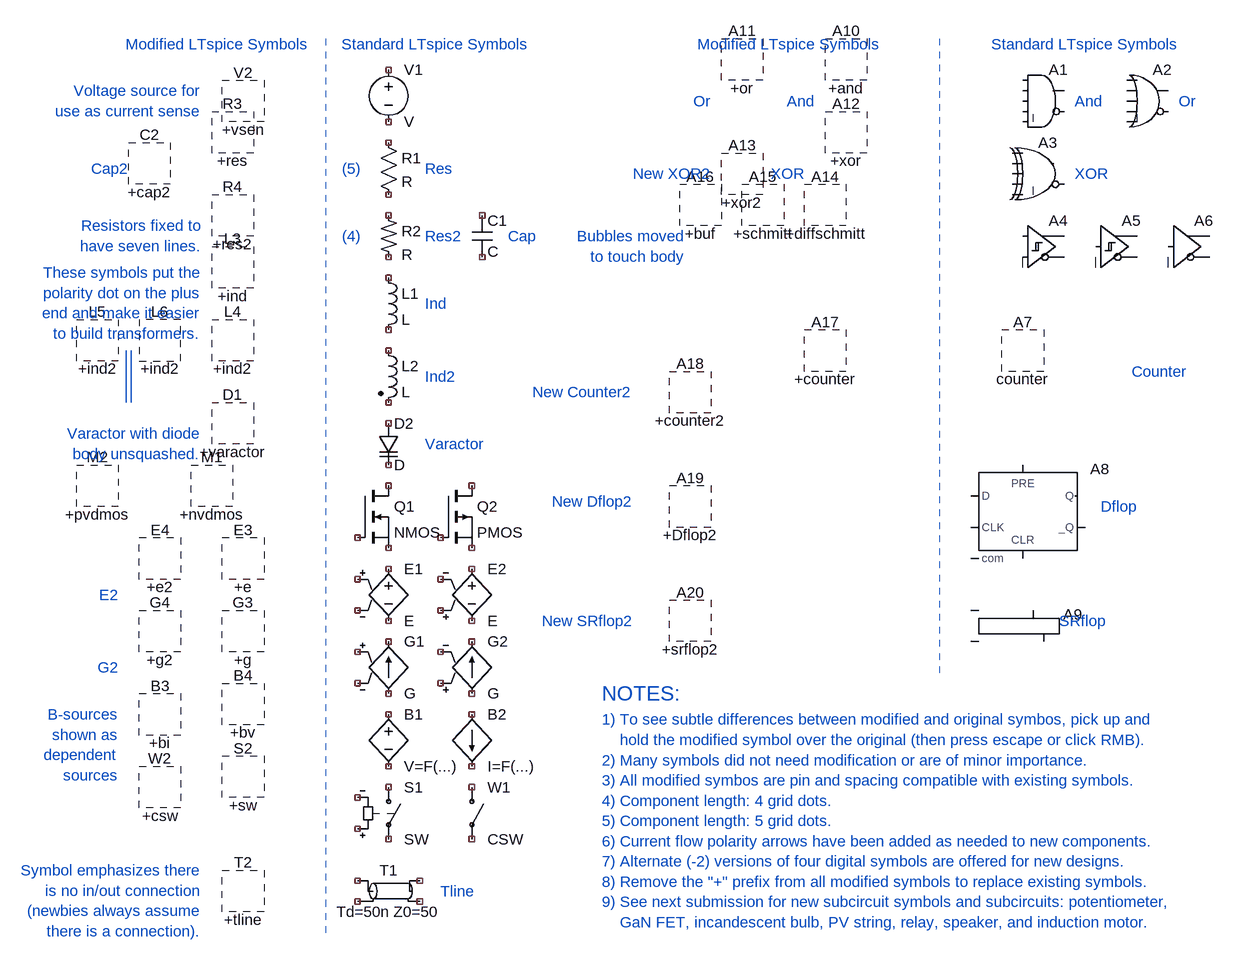
[diagram p0: schematic symbols.asc]
symbols.asc, the LTspice schematic file:
Version 4
SHEET 1 2616 1896
SYMBOL +varactor -160 224 R0
SYMATTR InstName D1
SYMATTR Description Diode
SYMBOL res 64 -224 R0
SYMATTR InstName R1
SYMBOL res2 64 -96 R0
SYMATTR InstName R2
SYMBOL ind 64 -16 R0
SYMATTR InstName L1
SYMBOL ind2 64 96 R0
SYMATTR InstName L2
SYMBOL varactor 64 224 R0
SYMATTR InstName D2
SYMBOL e 80 432 R0
SYMATTR InstName E1
SYMBOL e2 208 432 R0
SYMATTR InstName E2
SYMBOL g 80 544 R0
SYMATTR InstName G1
SYMBOL g2 208 544 R0
SYMATTR InstName G2
SYMBOL sw 80 768 R0
SYMATTR InstName S1
SYMBOL csw 208 784 R0
SYMATTR InstName W1
SYMBOL tline 80 944 R0
SYMATTR InstName T1
SYMBOL Digital\\and 1088 -336 R0
SYMATTR InstName A1
SYMBOL Digital\\or 1248 -336 R0
SYMATTR InstName A2
SYMBOL Digital\\xor 1088 -224 R0
SYMATTR InstName A3
SYMBOL Digital\\diffschmitt 1056 -112 R0
SYMATTR InstName A4
SYMBOL Digital\\schmitt 1168 -112 R0
SYMATTR InstName A5
SYMBOL Digital\\buf 1280 -112 R0
SYMATTR InstName A6
SYMBOL Digital\\counter 1056 112 R0
SYMATTR InstName A7
SYMBOL Digital\\dflop 1056 288 R0
SYMATTR InstName A8
SYMBOL Digital\\srflop 1024 464 R0
SYMATTR InstName A9
SYMBOL +res -160 -224 R0
SYMATTR InstName R3
SYMATTR Description A resistor
SYMBOL +res2 -160 -96 R0
SYMATTR InstName R4
SYMATTR Description A resistor
SYMBOL +ind -160 -16 R0
SYMATTR InstName L3
SYMBOL +ind2 -160 96 R0
SYMATTR InstName L4
SYMBOL +ind2 -368 96 R0
SYMATTR InstName L5
SYMBOL +ind2 -272 96 M0
SYMATTR InstName L6
SYMBOL +e -144 432 R0
SYMATTR InstName E3
SYMBOL +e2 -272 432 R0
SYMATTR InstName E4
SYMBOL +g -144 544 R0
SYMATTR InstName G3
SYMBOL +g2 -272 544 R0
SYMATTR InstName G4
SYMBOL +sw -144 768 R0
SYMATTR InstName S2
SYMBOL +csw -272 784 R0
SYMATTR InstName W2
SYMBOL +tline -144 944 R0
SYMATTR InstName T2
SYMBOL +and 784 -336 R0
SYMATTR InstName A10
SYMBOL +or 624 -336 R0
SYMATTR InstName A11
SYMBOL +xor 784 -224 R0
SYMATTR InstName A12
SYMATTR Description Behavioral OR gate with complementary outputs
SYMBOL +xor2 624 -160 R0
SYMATTR InstName A13
SYMATTR Description Behavioral OR gate with complementary outputs
SYMBOL +diffschmitt 752 -112 R0
SYMATTR InstName A14
SYMBOL +schmitt 656 -112 R0
SYMATTR InstName A15
SYMBOL +buf 560 -112 R0
SYMATTR InstName A16
SYMBOL +counter 752 112 R0
SYMATTR InstName A17
SYMBOL +counter2 544 176 R0
SYMATTR InstName A18
SYMBOL +Dflop2 544 352 R0
SYMATTR InstName A19
SYMBOL +srflop2 544 528 R0
SYMATTR InstName A20
SYMBOL bv 80 656 R0
SYMATTR InstName B1
SYMBOL bi 208 672 R0
SYMATTR InstName B2
SYMBOL +bi -272 672 R0
SYMATTR InstName B3
SYMBOL +bv -144 656 R0
SYMATTR InstName B4
SYMBOL nmos 32 320 R0
SYMATTR InstName Q1
SYMBOL pmos 160 320 R0
SYMATTR InstName Q2
SYMBOL voltage 80 -336 R0
SYMATTR InstName V1
SYMBOL cap 208 -96 R0
SYMATTR InstName C1
SYMBOL +cap2 -288 -176 R0
SYMATTR InstName C2
SYMBOL +nvdmos -192 320 R0
SYMATTR InstName M1
SYMBOL +pvdmos -368 320 R0
SYMATTR InstName M2
SYMBOL +vsen -144 -272 R0
SYMATTR InstName V2
TEXT 152 -344 Bottom 2 ;Standard LTspice Symbols
TEXT -184 -344 Bottom 2 ;Modified LTspice Symbols
TEXT 136 -64 Left 2 ;Res2
TEXT 136 -168 Left 2 ;Res
TEXT 160 944 Left 2 ;Tline
TEXT -208 912 Right 2 ;Symbol emphasizes there\nis no in/out connection\n(newbies always assume\nthere is a connection).
TEXT 136 40 Left 2 ;Ind
TEXT 136 152 Left 2 ;Ind2
TEXT -208 -8 Right 2 ;These symbols put the\npolarity dot on the plus\nend and make it easier\nto build transformers.
TEXT 1224 144 Left 2 ;Counter
TEXT 1176 352 Left 2 ;Dflop
TEXT 1112 528 Left 2 ;SRflop
TEXT 456 528 Right 2 ;New SRflop2
TEXT 456 344 Right 2 ;New Dflop2
TEXT 136 256 Left 2 ;Varactor
TEXT -208 240 Right 2 ;Varactor with diode\nbody unsquashed.
TEXT -208 -80 Right 2 ;Resistors fixed to\nhave seven lines.
TEXT 456 176 Right 2 ;New Counter2
TEXT 576 -160 Right 2 ;New XOR2
TEXT 536 -64 Right 2 ;Bubbles moved\nto touch body
TEXT 1136 -272 Left 2 ;And
TEXT 1296 -272 Left 2 ;Or
TEXT 1136 -160 Left 2 ;XOR
TEXT 696 -344 Bottom 2 ;Modified LTspice Symbols
TEXT 1152 -344 Bottom 2 ;Standard LTspice Symbols
TEXT -336 488 Right 2 ;E2
TEXT -336 600 Right 2 ;G2
TEXT 408 640 Left 3 ;NOTES:
TEXT 408 680 Left 2 ;1) To see subtle differences between modified and original symbos, pick up and\n    hold the modified symbol over the original (then press escape or click RMB).\n2) Many symbols did not need modification or are of minor importance.\n3) All modified symbos are pin and spacing compatible with existing symbols.\n4) Component length: 4 grid dots.\n5) Component length: 5 grid dots.\n6) Current flow polarity arrows have been added as needed to new components.\n7) Alternate (-2) versions of four digital symbols are offered for new designs.\n8) Remove the "+" prefix from all modified symbols to replace existing symbols.\n9) See next submission for new subcircuit symbols and subcircuits: potentiometer,\n    GaN FET, incandescent bulb, PV string, relay, speaker, and induction motor.
TEXT -336 672 Right 2 ;B-sources\nshown as\ndependent\nsources
TEXT 736 -272 Right 2 ;And
TEXT 576 -272 Right 2 ;Or
TEXT 720 -160 Right 2 ;XOR
TEXT -208 -288 Right 2 ;Voltage source for\nuse as current sense
TEXT 264 -64 Left 2 ;Cap
TEXT -320 -168 Right 2 ;Cap2
TEXT 8 -168 Left 2 ;(5)
TEXT 8 -64 Left 2 ;(4)
LINE Normal 928 608 928 -368 1
LINE Normal -16 1008 -16 -368 1
LINE Normal -316 192 -316 112
LINE Normal -324 112 -324 192

The netlist it stands for:
* symbols.asc
* D1: +varactor (symbol +varactor not available, pin order unknown); nets seen at it: 
R1 NC_01 NC_02 R
R2 NC_03 NC_04 R
L1 NC_05 NC_06 L
L2 NC_07 NC_08 L
D2 NC_09 NC_10 D
E1 NC_11 NC_12 NC_13 NC_14 E
E2 NC_15 NC_16 NC_17 NC_18 E
G1 NC_19 NC_20 NC_21 NC_22 G
G2 NC_23 NC_24 NC_25 NC_26 G
S1 NC_27 NC_28 NC_29 NC_30 SW
W1 NC_31 NC_32 CSW
T1 NC_33 NC_34 NC_35 NC_36 Td=50n Z0=50
A1 0 0 0 0 0 0 0 0 AND
A2 0 0 0 0 0 0 0 0 OR
A3 0 0 0 0 0 0 0 0 XOR
A4 0 0 0 0 0 0 0 0 SCHMITT
A5 0 0 0 0 0 0 0 0 SCHMITT
A6 0 0 0 0 0 0 0 0 BUF
* A7: counter (symbol Digital\counter not available, pin order unknown); nets seen at it: 
A8 0 0 0 0 0 0 0 0 DFLOP
A9 0 0 0 0 0 0 0 0 SRFLOP
* R3: +res (symbol +res not available, pin order unknown); nets seen at it: 
* R4: +res2 (symbol +res2 not available, pin order unknown); nets seen at it: 
* L3: +ind (symbol +ind not available, pin order unknown); nets seen at it: 
* L4: +ind2 (symbol +ind2 not available, pin order unknown); nets seen at it: 
* L5: +ind2 (symbol +ind2 not available, pin order unknown); nets seen at it: 
* L6: +ind2 (symbol +ind2 not available, pin order unknown); nets seen at it: 
* E3: +e (symbol +e not available, pin order unknown); nets seen at it: 
* E4: +e2 (symbol +e2 not available, pin order unknown); nets seen at it: 
* G3: +g (symbol +g not available, pin order unknown); nets seen at it: 
* G4: +g2 (symbol +g2 not available, pin order unknown); nets seen at it: 
* S2: +sw (symbol +sw not available, pin order unknown); nets seen at it: 
* W2: +csw (symbol +csw not available, pin order unknown); nets seen at it: 
* T2: +tline (symbol +tline not available, pin order unknown); nets seen at it: 
* A10: +and (symbol +and not available, pin order unknown); nets seen at it: 
* A11: +or (symbol +or not available, pin order unknown); nets seen at it: 
* A12: +xor (symbol +xor not available, pin order unknown); nets seen at it: 
* A13: +xor2 (symbol +xor2 not available, pin order unknown); nets seen at it: 
* A14: +diffschmitt (symbol +diffschmitt not available, pin order unknown); nets seen at it: 
* A15: +schmitt (symbol +schmitt not available, pin order unknown); nets seen at it: 
* A16: +buf (symbol +buf not available, pin order unknown); nets seen at it: 
* A17: +counter (symbol +counter not available, pin order unknown); nets seen at it: 
* A18: +counter2 (symbol +counter2 not available, pin order unknown); nets seen at it: 
* A19: +Dflop2 (symbol +Dflop2 not available, pin order unknown); nets seen at it: 
* A20: +srflop2 (symbol +srflop2 not available, pin order unknown); nets seen at it: 
B1 NC_37 NC_38 V=F(...)
B2 NC_39 NC_40 I=F(...)
* B3: +bi (symbol +bi not available, pin order unknown); nets seen at it: 
* B4: +bv (symbol +bv not available, pin order unknown); nets seen at it: 
M§Q1 NC_41 NC_42 NC_43 NC_43 NMOS
M§Q2 NC_44 NC_45 NC_46 NC_46 PMOS
V1 NC_47 NC_48 V
C1 NC_49 NC_50 C
* C2: +cap2 (symbol +cap2 not available, pin order unknown); nets seen at it: 
* M1: +nvdmos (symbol +nvdmos not available, pin order unknown); nets seen at it: 
* M2: +pvdmos (symbol +pvdmos not available, pin order unknown); nets seen at it: 
* V2: +vsen (symbol +vsen not available, pin order unknown); nets seen at it: 
.model D D
.lib standard.dio
.model NMOS NMOS
.model PMOS PMOS
.lib standard.mos
* Standard LTspice Symbols
* Modified LTspice Symbols
* Res2
* Res
* Tline
* Symbol emphasizes there
* is no in/out connection
* (newbies always assume
* there is a connection).
* Ind
* Ind2
* These symbols put the
* polarity dot on the plus
* end and make it easier
* to build transformers.
* Counter
* Dflop
* SRflop
* New SRflop2
* New Dflop2
* Varactor
* Varactor with diode
* body unsquashed.
* Resistors fixed to
* have seven lines.
* New Counter2
* New XOR2
* Bubbles moved
* to touch body
* And
* Or
* XOR
* Modified LTspice Symbols
* Standard LTspice Symbols
* E2
* G2
* NOTES:
* 1) To see subtle differences between modified and original symbos, pick up and
*     hold the modified symbol over the original (then press escape or click RMB).
* 2) Many symbols did not need modification or are of minor importance.
* 3) All modified symbos are pin and spacing compatible with existing symbols.
* 4) Component length: 4 grid dots.
* 5) Component length: 5 grid dots.
* 6) Current flow polarity arrows have been added as needed to new components.
* 7) Alternate (-2) versions of four digital symbols are offered for new designs.
* 8) Remove the "+" prefix from all modified symbols to replace existing symbols.
* 9) See next submission for new subcircuit symbols and subcircuits: potentiometer,
*     GaN FET, incandescent bulb, PV string, relay, speaker, and induction motor.
* B-sources
* shown as
* dependent
* sources
* And
* Or
* XOR
* Voltage source for
* use as current sense
* Cap
* Cap2
* (5)
* (4)
.backanno
.end